# Altium schematic sheet BB.GW.001.01.00 Э3 (Силовой модуль).SchDoc
size 420 x 297 mm; Scale: {Масш.}; Title1str: Модуль силовой; PageSetup: Record=PageOptions|CenterHorizontal=False|CenterVertical=False|PrintScale=0.95|XCorrection=0.00|YCorrection=0.00|PrintKind=1|BorderSize=5000000|LeftOffset=0|BottomOffset=0|Orientation=1|PaperLength=1000|PaperWidth=1000|Scale=100|PaperSource=15|PrintQuality=600|MediaType=1|DitherType=10|PaperKind=A4|PrintScaleMode=1; ProcessInspection: {Т.контр.}; Mass: {Масса}; NormInspection: {Н.контр.}; EngineerName: {Инженер}; Letter1Column: {}; Letter2Column: {}; Letter3Column: {}; DocumentType: {Документ}; DocumentType1str: {Документ}; DocumentType2str: {Документ}; NachKonstrSekt: {Нач. КС}; NachPodrVydTz: {Рук.подр.выд.ТЗ}; NachSektNadezn: {Нач. СН}; ZamPoKonstr: {ZamPoKonstr}
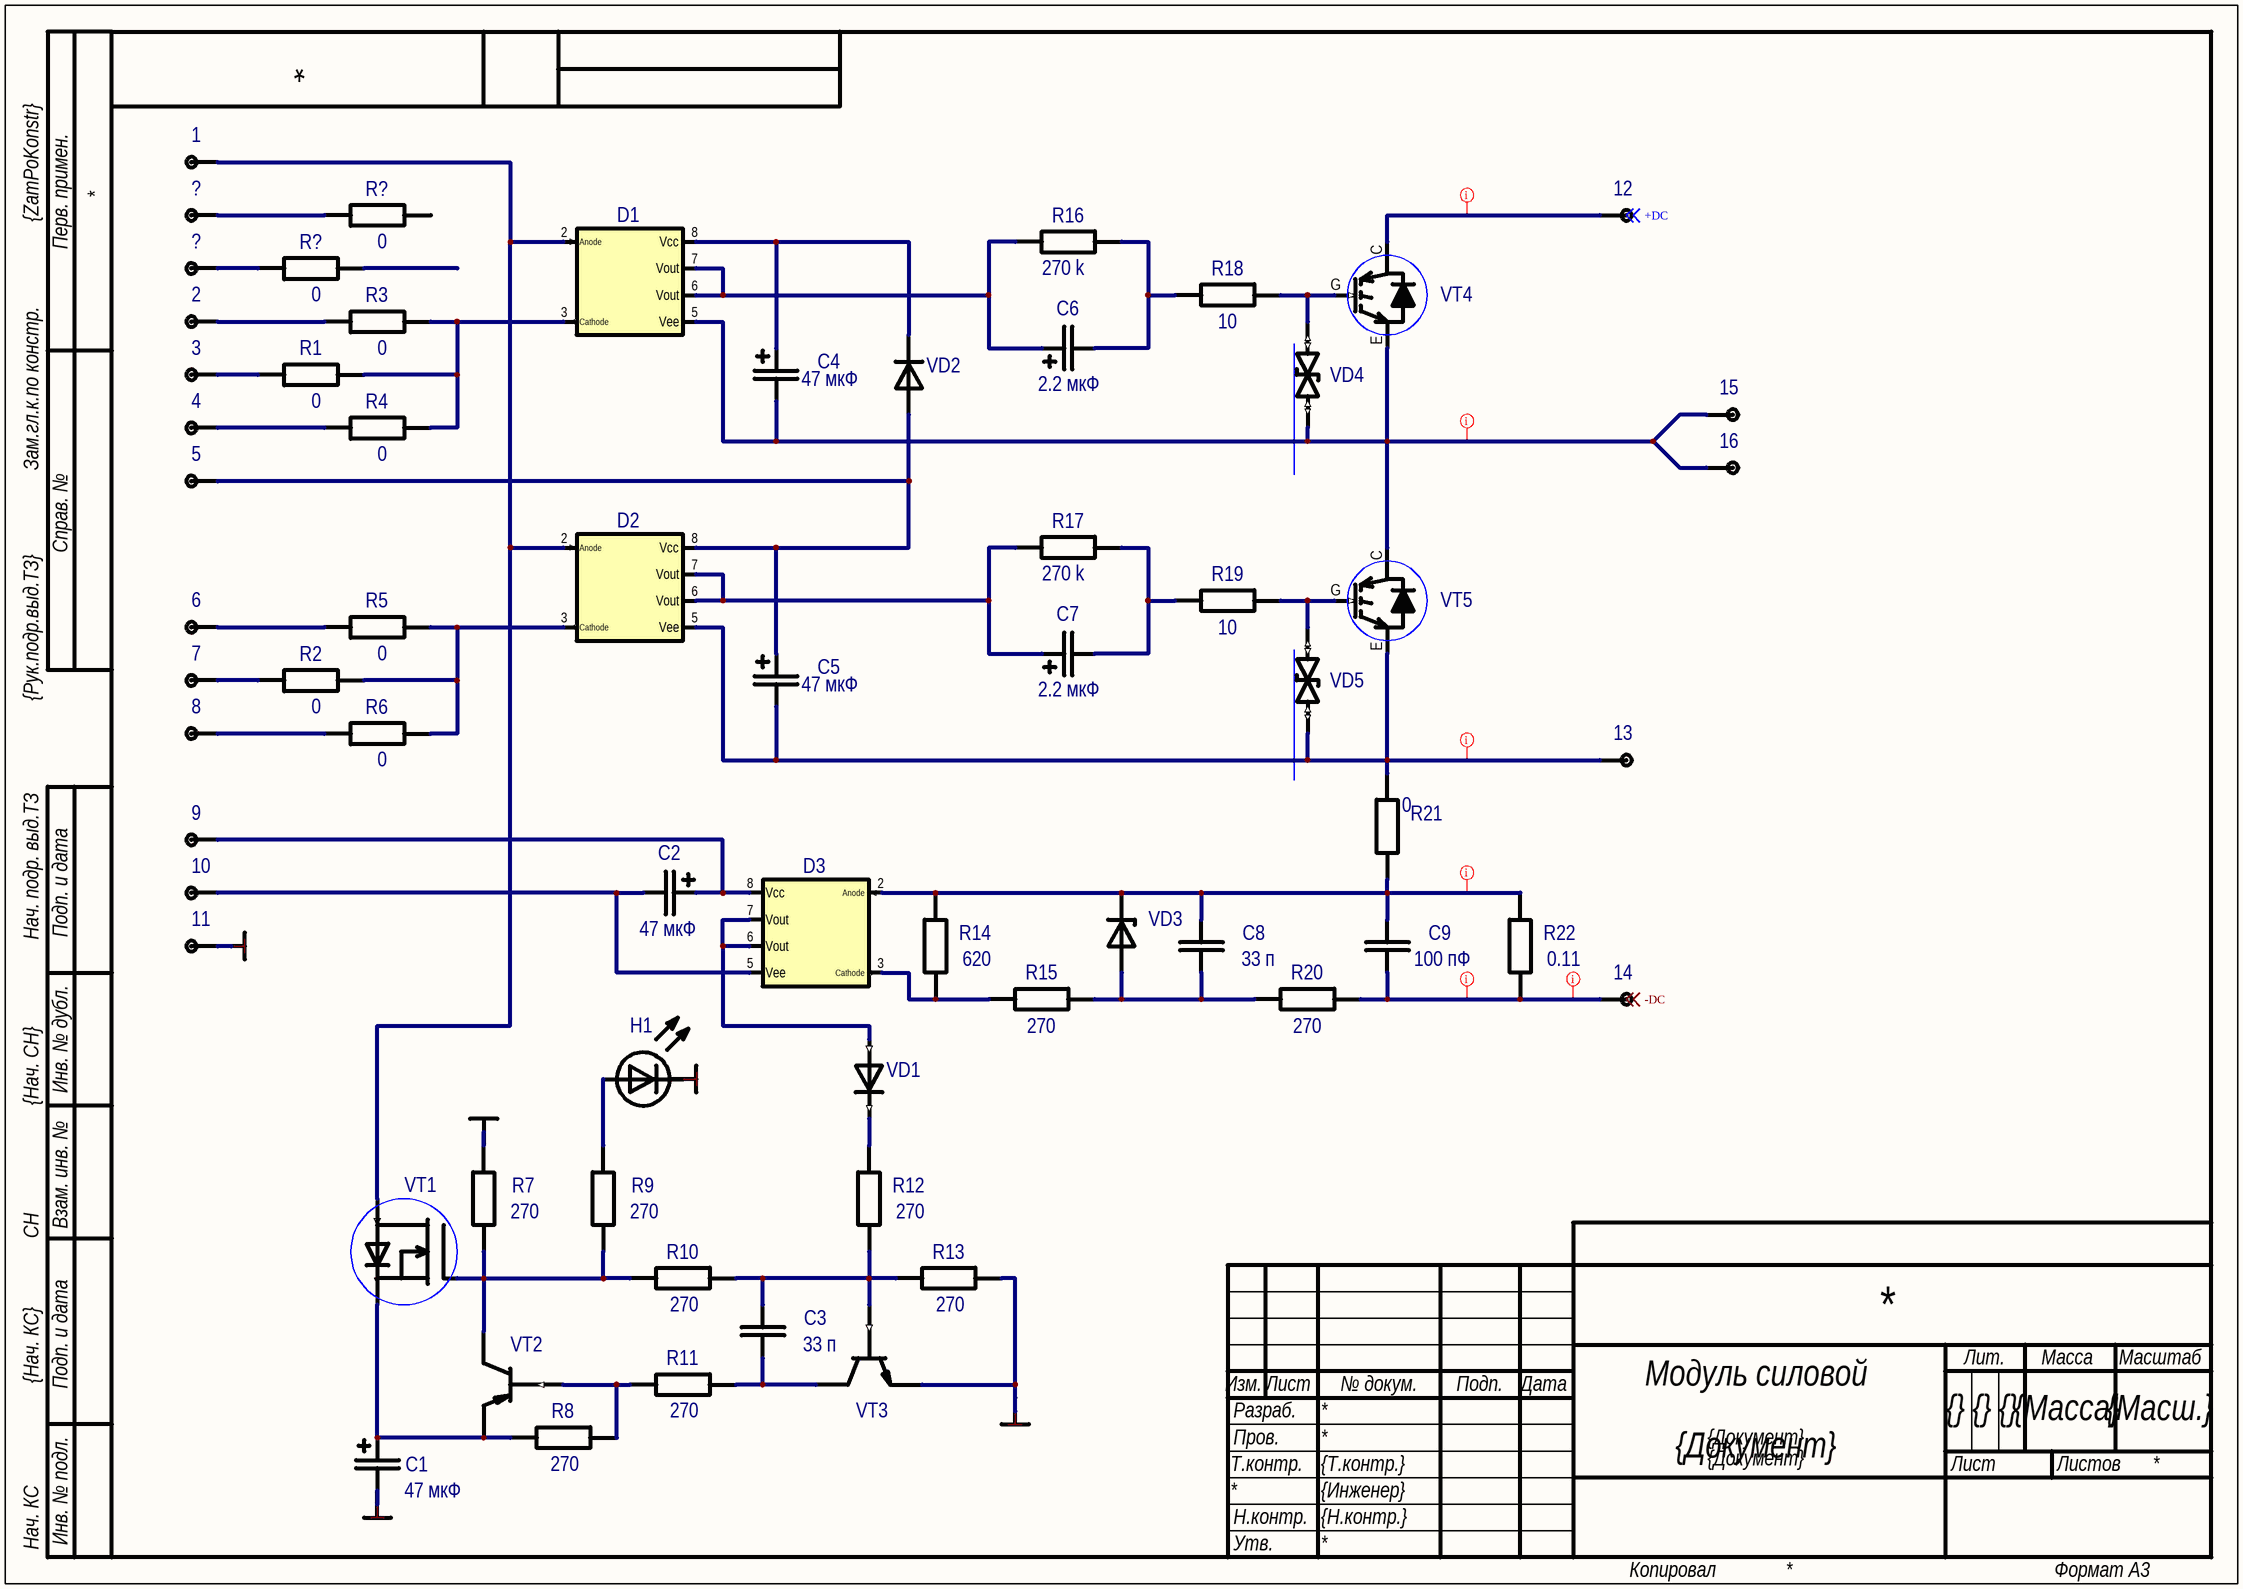
[diagram p0: BB.GW.001.01.00 Э3 (Силовой модуль).SchDoc]

## Parts
(Parts that share a designator on the sheet are numbered #1, #2 ... from top to bottom, then left to right.)
1  TP  [TP1]  (value not drawn)  (no BOM)
2  TP  [TP1]  (value not drawn)  (no BOM)
3  TP  [TP1]  (value not drawn)  (no BOM)
4  TP  [TP1]  (value not drawn)  (no BOM)
5  TP  [TP1]  (value not drawn)  (no BOM)
6  TP  [TP1]  (value not drawn)  (no BOM)
7  TP  [TP1]  (value not drawn)  (no BOM)
8  TP  [TP1]  (value not drawn)  (no BOM)
9  TP  [TP1]  (value not drawn)  (no BOM)
10  TP  [TP1]  (value not drawn)  (no BOM)
11  TP  [TP1]  (value not drawn)  (no BOM)
12  TP  [TP1]  (value not drawn)  (no BOM)
13  TP  [TP1]  (value not drawn)  (no BOM)
14  TP  [TP1]  (value not drawn)  (no BOM)
15  TP  [TP1]  (value not drawn)  (no BOM)
16  TP  [TP1]  (value not drawn)  (no BOM)
?#1  TP  [TP1]  (value not drawn)  (no BOM)
?#2  TP  [TP1]  (value not drawn)  (no BOM)
C1  47 мкФ  [CAPMP7343X31N]
C2  47 мкФ  [CAPMP7343X31N]
C3  33 п  [CAPC3216M]
C4  47 мкФ  [CAPMP7343X31N]
C5  47 мкФ  [CAPMP7343X31N]
C6  2.2 мкФ  [CAPMP7343X31N]
C7  2.2 мкФ  [CAPMP7343X31N]
C8  33 п  [CAPC3216M]
C9  100 пФ  [CAPC3216M]
D1  МикросхемаHCPL-3120  [DIP-8]  (value not drawn)
D2  МикросхемаHCPL-3120  [DIP-8]  (value not drawn)
D3  МикросхемаHCPL-3120  [DIP-8]  (value not drawn)
GND#1  GND GOST  (value not drawn)  (graphical)
GND#2  GND GOST  (value not drawn)  (graphical)
GND#3  GND GOST  (value not drawn)  (graphical)
GND#4  GND GOST  (value not drawn)  (graphical)
GND?  GND GOST  (value not drawn)  (graphical)
H1  KPG-1608ZGC  [LED_1608X25N]  (value not drawn)
R1  0  [RESC3216M]
R2  0  [RESC3216M]
R3  0  [RESC3216M]
R4  0  [RESC3216M]
R5  0  [RESC3216M]
R6  0  [RESC3216M]
R7  270  [RESC3216M]
R8  270  [RESC3216M]
R9  270  [RESC3216M]
R10  270  [RESC3216M]
R11  270  [RESC3216M]
R12  270  [RESC3216M]
R13  270  [RESC3216M]
R14  620  [RESC3216M]
R15  270  [RESC3216M]
R16  270 k  [RESC3216M]
R17  270 k  [RESC3216M]
R18  10  [RESC3216M]
R19  10  [RESC3216M]
R20  270  [RESC3216M]
R21  0  [RESC3216M]
R22  0.11  [RESW_SQP-7]
R?#1  0  [RESC3216M]
R?#2  0  [RESC3216M]
VD1  1N4148  [SOD-123]  (value not drawn)
VD2  FR20  [DO-15]  (value not drawn)
VD3  BZX5V1  [DO-35]  (value not drawn)
VD4  Stabistor_P6KE15CA  [D2A]  (value not drawn)
VD5  Stabistor_P6KE15CA  [D2A]  (value not drawn)
VT1  F9Z34N  [TO-220_TH_Horizontal_Var#1]  (value not drawn)
VT2  TRANSBIPOL_КТ361  [Rus_КT-13]  (value not drawn)
VT3  TRANSBIPOL_КТ315  [Rus_КT-13]  (value not drawn)
VT4  IGBT_IRG7PH42UD2PDF  [TO-247AC]  (value not drawn)
VT5  IGBT_IRG7PH42UD2PDF  [TO-247AC]  (value not drawn)

## Nets
GND: 11.1 C1.1 H1.2(Cathode) R7.2 R13.2 VT3.E
Net1_1: 1.1 D1.2(Anode) D2.2(Anode) VT1.Drain
Net2_1: 2.1 R3.2
Net3_1: 3.1 R1.2
Net4_1: 4.1 R4.2
Net5_1: 5.1 C5.2 D2.8(Vcc) VD2.1(Anode)
Net6_1: 6.1 R5.2
Net7_1: 7.1 R2.2
Net8_1: 8.1 R6.2
Net9_1: 9.1 C2.2 D3.8(Vcc)
Net10_1: 10.1 C2.1 D3.5(Vee)
Net12_1: 12.1 VT4.C
Net13_1: 13.1 C5.1 D2.5(Vee) R21.2 VD5.1(Anode) VT5.E
Net14_1: 14.1 C9.2 R20.2 R22.1
Net15_1: 15.1 16.1 C4.1 D1.5(Vee) VD4.1(Anode) VT4.E VT5.C
Net?#1_1: ?#1.1 R?#1.2
Net?#2_1: ?#2.1 R?#2.2
NetC1_2: C1.2 R8.1 VT1.Sourse VT2.E
NetC3_1: C3.1 R10.2 R12.1 R13.1 VT3.B
NetC3_2: C3.2 R11.2 VT3.C
NetC4_2: C4.2 D1.8(Vcc) VD2.2(Cathode)
NetC6_1: C6.1 R16.2 R18.1
NetC6_2: C6.2 D1.6(Vout) D1.7(Vout) R16.1
NetC7_1: C7.1 R17.2 R19.1
NetC7_2: C7.2 D2.6(Vout) D2.7(Vout) R17.1
NetC8_1: C8.1 C9.1 D3.2(Anode) R14.2 R21.1 R22.2 VD3.2(Cathode)
NetC8_2: C8.2 R15.2 R20.1 VD3.1(Anode)
NetD1_3: D1.3(Cathode) R1.1 R3.1 R4.1
NetD2_3: D2.3(Cathode) R2.1 R5.1 R6.1
NetD3_3: D3.3(Cathode) R14.1 R15.1
NetD3_6: D3.6(Vout) D3.7(Vout) VD1.1(Anode)
NetH1_1: H1.1(Anode) R9.2
NetR7_1: R7.1 R9.1 R10.1 VT1.Gate VT2.C
NetR8_2: R8.2 R11.1 VT2.B
NetR12_2: R12.2 VD1.2(Cathode)
NetR18_2: R18.2 VD4.2(Cathode) VT4.G
NetR19_2: R19.2 VD5.2(Cathode) VT5.G

Not connected (* = marked no-connect by the designer): R?#1 1; R?#2 1

## Layout directives
net class PowerLine: Net12_1, Net13_1, Net14_1, Net15_1, NetC8_1

## Notes on the sheet
- Labels drawn without touching a wire or pin: +DC, -DC
- Перв. примен.
- Зам.гл.к.по констр.
- Справ. №
- Нач. подр. выд.ТЗ
- Подп. и дата
- Инв. № дубл.
- Взам. инв. №
- СН
- Изм.
- Лист
- № докум.
- Подп.
- Дата
- Лит.
- Масса
- Масштаб
- Т.контр.
- Пров.
- Разраб.
- Листов
- Нач. КС
- Инв. № подл.
- Н.контр.
- Утв.
- Копировал
- Формат А3

## Library data of the parts
1-16 ?#1 ?#2 = TP: Test point
C1 C2 C4 C5 C7 = Capacitor_Polar_TAJD: Танталовый конденсатор; Name: TAJD; Power/Voltage: 50 B; Tolerance: {Tolerance}; BCPId: *; Manufacturer: *; TKE/TKC: *; ManufacturerPartNumber: *; Type: Конденсатор
  C1 C2 C4 C5: Value: 47 мкФ
  C7: Value: 2.2 мкФ
C3 C8 C9 = Capacitor_Chip: Чип-конденсатор; Name: 1206; Power/Voltage: 50 B; TKE/TKC: {TKE/TKC}; Tolerance: {Tolerance}; BCPId: *; Manufacturer: *; ManufacturerPartNumber: *; Type: Конденсатор
  C3 C8: Value: 33 п
  C9: Value: 100 пФ
C6 = Capacitor_Polar_TAJD: Танталовый конденсатор; Name: TAJD; Power/Voltage: 50; Tolerance: {Tolerance}; BCPId: *; Manufacturer: *; TKE/TKC: *; ManufacturerPartNumber: *; Type: Конденсатор; Value: 2.2 мкФ
D1 = Device_HCPL-3120: 2.5 Amp Output Current IGBT Gate Drive Optocoupler; Manufacturer: Avago, Avago Technologies; Rule: Undefined; ManufacturerPartNumber: HCPL-3120; BCPId: *; Category: Микросхема; ComponentLink1URL: k:\Projects\BB.001.00.00 (Преобразователь частотный)\Datashets\Функциональная группа ''A1''\hcpl-3120-500e.pdf; ComponentLink1Description: DataSheet; ComponentLink2Description: Package; ComponentLink2URL: k:\Projects\BB.001.00.00 (Преобразователь частотный)\Datashets\Функциональная группа ''A1''\hcpl-3120-500e.pdf#page=3
D2 D3 = Device_HCPL-3120: 2.5 Amp Output Current IGBT Gate Drive Optocoupler; Manufacturer: Avago, Avago Technologies; Rule: PcbType=ProtelPcb; ManufacturerPartNumber: HCPL-3120; BCPId: *; Category: Микросхема; ComponentLink1URL: k:\Projects\BB.001.00.00 (Преобразователь частотный)\Datashets\Функциональная группа ''A1''\hcpl-3120-500e.pdf; ComponentLink1Description: DataSheet; ComponentLink2Description: Package; ComponentLink2URL: k:\Projects\BB.001.00.00 (Преобразователь частотный)\Datashets\Функциональная группа ''A1''\hcpl-3120-500e.pdf#page=3
GND#1-GND#4 GND? = GND GOST: Корпус ЕСКД. Для "наложения" на штатный GOST Power Bar
H1 = LED: Светодиод; Manufacturer: Kingbright; BCPId: *; Rem: *; Package: *; ManufacturerPartNumber: KPG-1608ZGC; Type: Светодиод; TU/GOST: *; HelpURL: *; Price: *
R1-R21 R?#1 R?#2 = Resistor_Chip: Чип-резистор; Tolerance: {Tolerance}; BCPId: *; Manufacturer: *; Name: *; Type: Резистор
  R1-R6 R21 R?#1 R?#2: Value: 0
  R7-R13 R15 R20: Value: 270
  R14: Value: 620
  R16 R17: Value: 270 k
  R18 R19: Value: 10
R22 = Resistor_TH: Резистор; Tolerance: {Tolerance}; BCPId: *; Manufacturer: *; Name: *; Type: Резистор; Value: 0.11
VD1 = Diode_4148: Диод; Manufacturer: WTE power Semiconductor; BCPId: *; Rem: *; Package: *; ManufacturerPartNumber: 1N4148; Type: Диод; TU/GOST: *; HelpURL: *; Price: 3
VD2 = Diode_FR20..Serial: Диод; Manufacturer: WTE power Semiconductor; BCPId: *; Rem: *; Package: *; ManufacturerPartNumber: FR20; Type: Диод; TU/GOST: *; HelpURL: *; Price: *
VD3 = Diode_BZX5V1: Диод; Manufacturer: WTE power Semiconductor; BCPId: *; Rem: *; Package: *; ManufacturerPartNumber: BZX5V1; Type: Диод; TU/GOST: *; HelpURL: *; Price: *
VD4 VD5 = Stabistor_P6KE15CA: Стабилитрон; BCPId: *; Name: *; ManufacturerPartNumber: P6KE15CA; Type: Стабилитрон; Manufacturer: *
VT1 = FET_F9Z34N: Транзистор полевой; pin to pad: Drain>2+4 Gate>1 Sourse>3; ManufacturerPartNumber: F9Z34N; BCPId: *; Manufacturer: *; Package: Корпус КТ-9С; Type: Транзистор
VT2 = TRANSBIPOL_КТ361: Транзистор биполярный; ManufacturerPartNumber: КТ361; BCPId: *; Manufacturer: *; Package: KT-13; Type: Транзистор
VT3 = TRANSBIPOL_КТ315: Транзистор биполярный; ManufacturerPartNumber: КТ315; BCPId: *; Manufacturer: *; Package: KT-13; Type: Транзистор
VT4 VT5 = IGBT_IRG7PH42UD2PDF: insulated gate bipolar transistor with  ultrafast soft recovery diode; ManufacturerPartNumber: IRG7PH42UD2PDF; BCPId: *; Manufacturer: *; Package: TO-247AC